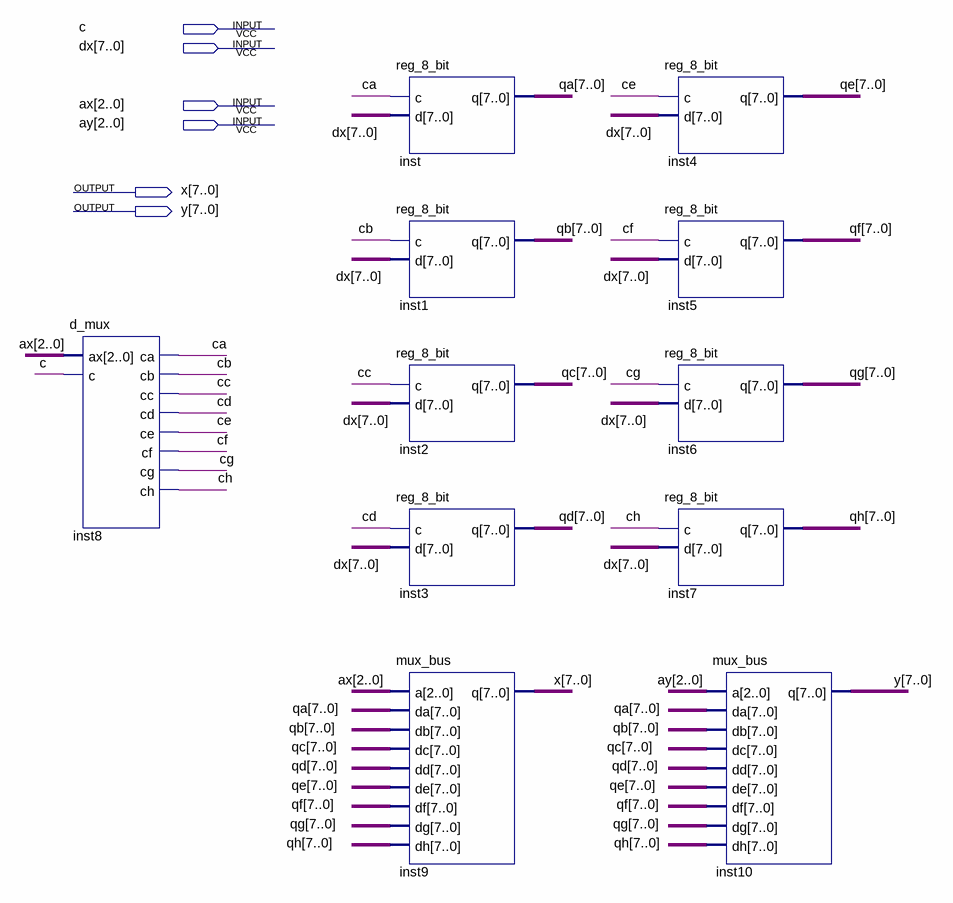
[diagram p0: schematic sheet]
// Quartus schematic block_ron.bdf as structural Verilog: 11 symbols, 6 pins
module block_ron (
  input  c,
  input  [7:0] dx,
  input  [2:0] ax,
  input  [2:0] ay,
  output [7:0] x,
  output [7:0] y
);

  wire ca, cb, cc, cd, ce, cf, cg, ch;
  wire [7:0] qa, qb, qc, qd, qe, qf, qg, qh;

  d_mux inst8 (.ax(ax), .c(c), .ca(ca), .cb(cb), .cc(cc), .cd(cd), .ce(ce), .cf(cf), .cg(cg), .ch(ch));
  reg_8_bit inst (.c(ca), .d(dx), .q(qa));
  reg_8_bit inst1 (.c(cb), .d(dx), .q(qb));
  reg_8_bit inst2 (.c(cc), .d(dx), .q(qc));
  reg_8_bit inst3 (.c(cd), .d(dx), .q(qd));
  mux_bus inst9 (.a(ax), .da(qa), .db(qb), .dc(qc), .dd(qd), .de(qe), .df(qf), .dg(qg), .dh(qh), .q(x));
  reg_8_bit inst4 (.c(ce), .d(dx), .q(qe));
  reg_8_bit inst5 (.c(cf), .d(dx), .q(qf));
  reg_8_bit inst6 (.c(cg), .d(dx), .q(qg));
  reg_8_bit inst7 (.c(ch), .d(dx), .q(qh));
  mux_bus inst10 (.a(ay), .da(qa), .db(qb), .dc(qc), .dd(qd), .de(qe), .df(qf), .dg(qg), .dh(qh), .q(y));
endmodule
